# Altium schematic sheet [05] Sensor.SchDoc
size A4
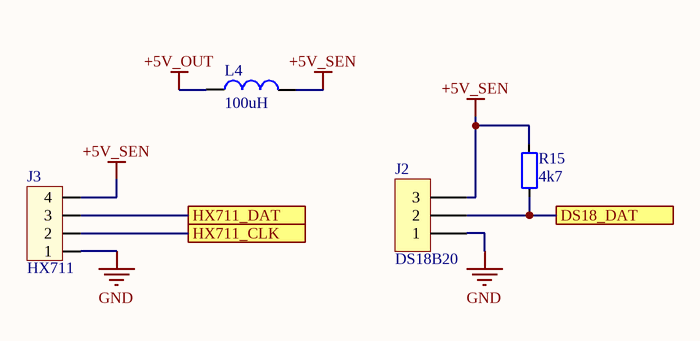
[diagram p0: [05] Sensor.SchDoc]

## Parts
J2  DS18B20  [HED 3P 15EDG3.81]
J3  HX711  [HED4B]
L4  100uH  [RES-SMD-0805]
R15  4k7  [RES-SMD-0805]

## Ports
DS18_DAT, HX711_CLK, HX711_DAT

## Nets
+5V_OUT: L4.1
+5V_SEN: J2.3 J3.4 L4.2 R15.2
GND: J2.1 J3.1
DS18_DAT: J2.2 R15.1 ; port DS18_DAT
HX711_CLK: J3.2 ; port HX711_CLK
HX711_DAT: J3.3 ; port HX711_DAT

## Library data of the parts
J2 = KF3: Manufacturer: Würth Elektronik eiSos GmbH; partNo: 691103110003; ComponentLink1 Description: Manufacturer; ComponentLink2 Description: Datasheet; NoPins: 3; Created Date: 29 October 2013; ComponentLink1URL: http://www.we-online.com; ComponentLink2URL: http://katalog.we-online.de/em/datasheet/6911031100xx.pdf; Created by: Karrer Zheng
J3 = Hed4: Header 4 (Green); Value: Header 4
L4 = Inductor: Value: 150 mH
R15 = Resistor - SMD: Resistor; Manufacturer: Generic Components; Class: Passive; Published: 08/06/2000; Publisher: Altium Hobart Technology Centre